# Altium schematic sheet Jinkono Схема электрическая функциональная.SchDoc
size 594 x 420 mm; Author: Гавриленко; CompanyName: OPEN SOURCE; Address1: Address1; Address2: Address2; Address3: Address3; Address4: Address4; SheetTotal: 1; DocumentType: Схема электрическая принципиальная
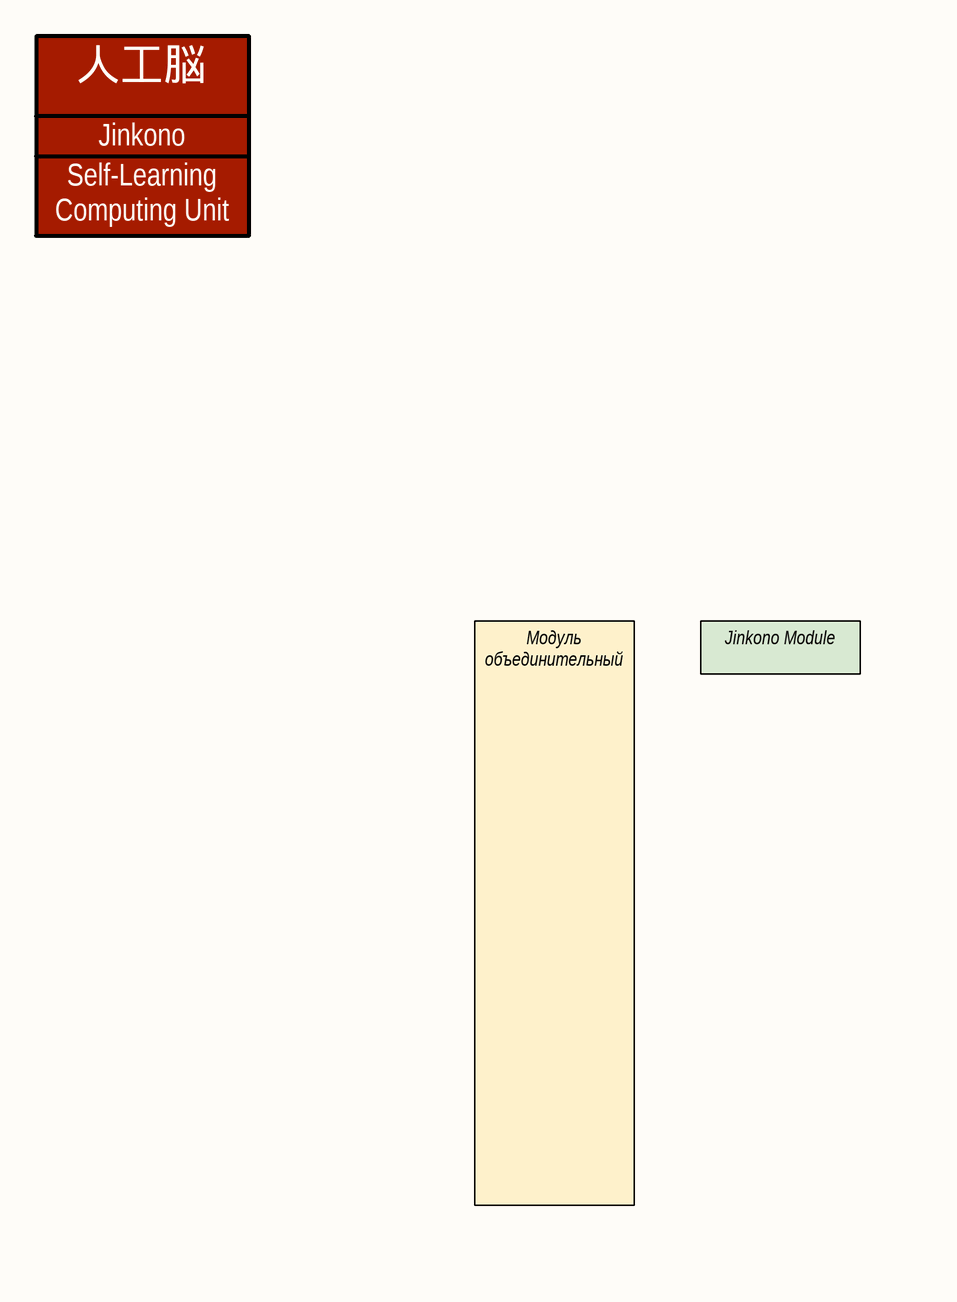
[diagram p0: Jinkono Схема электрическая функциональная.SchDoc, left]
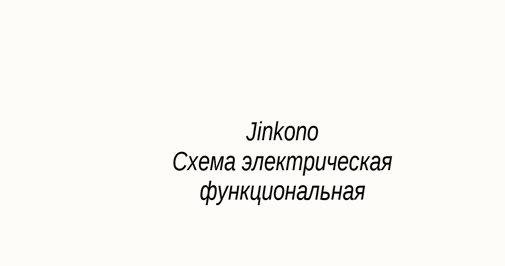
[diagram p1: Jinkono Схема электрическая функциональная.SchDoc, right]

## Notes on the sheet
- 人工脳
- Jinkono
- Self-Learning
  Computing Unit
- Jinkono Module
- Модуль
  объединительный
- Jinkono
  Схема электрическая
  функциональная
- Перв. примен.
- Справ. №
- Подп. и дата
- Инв. № дубл.
- Взам. инв. №
- Разраб.
- Изм.
- Лист
- № докум.
- Подп.
- Дата
- Лит.
- Масса
- Масштаб
- Пров.
- Т.контр.
- Листов
- Инв. № подл.
- Утв.
- Н.контр.
- 2.106-A2
- Копировал
- Формат А2